# EasyEDA schematic NFC Business Card 2024 Jan 06.json
TITLE: My NFC Hacker Card; REV: 1.0; Date: 2024-01-01; Sheet: 1/1; Drawn By: Karthick Arun; Company: <insert name here> lol
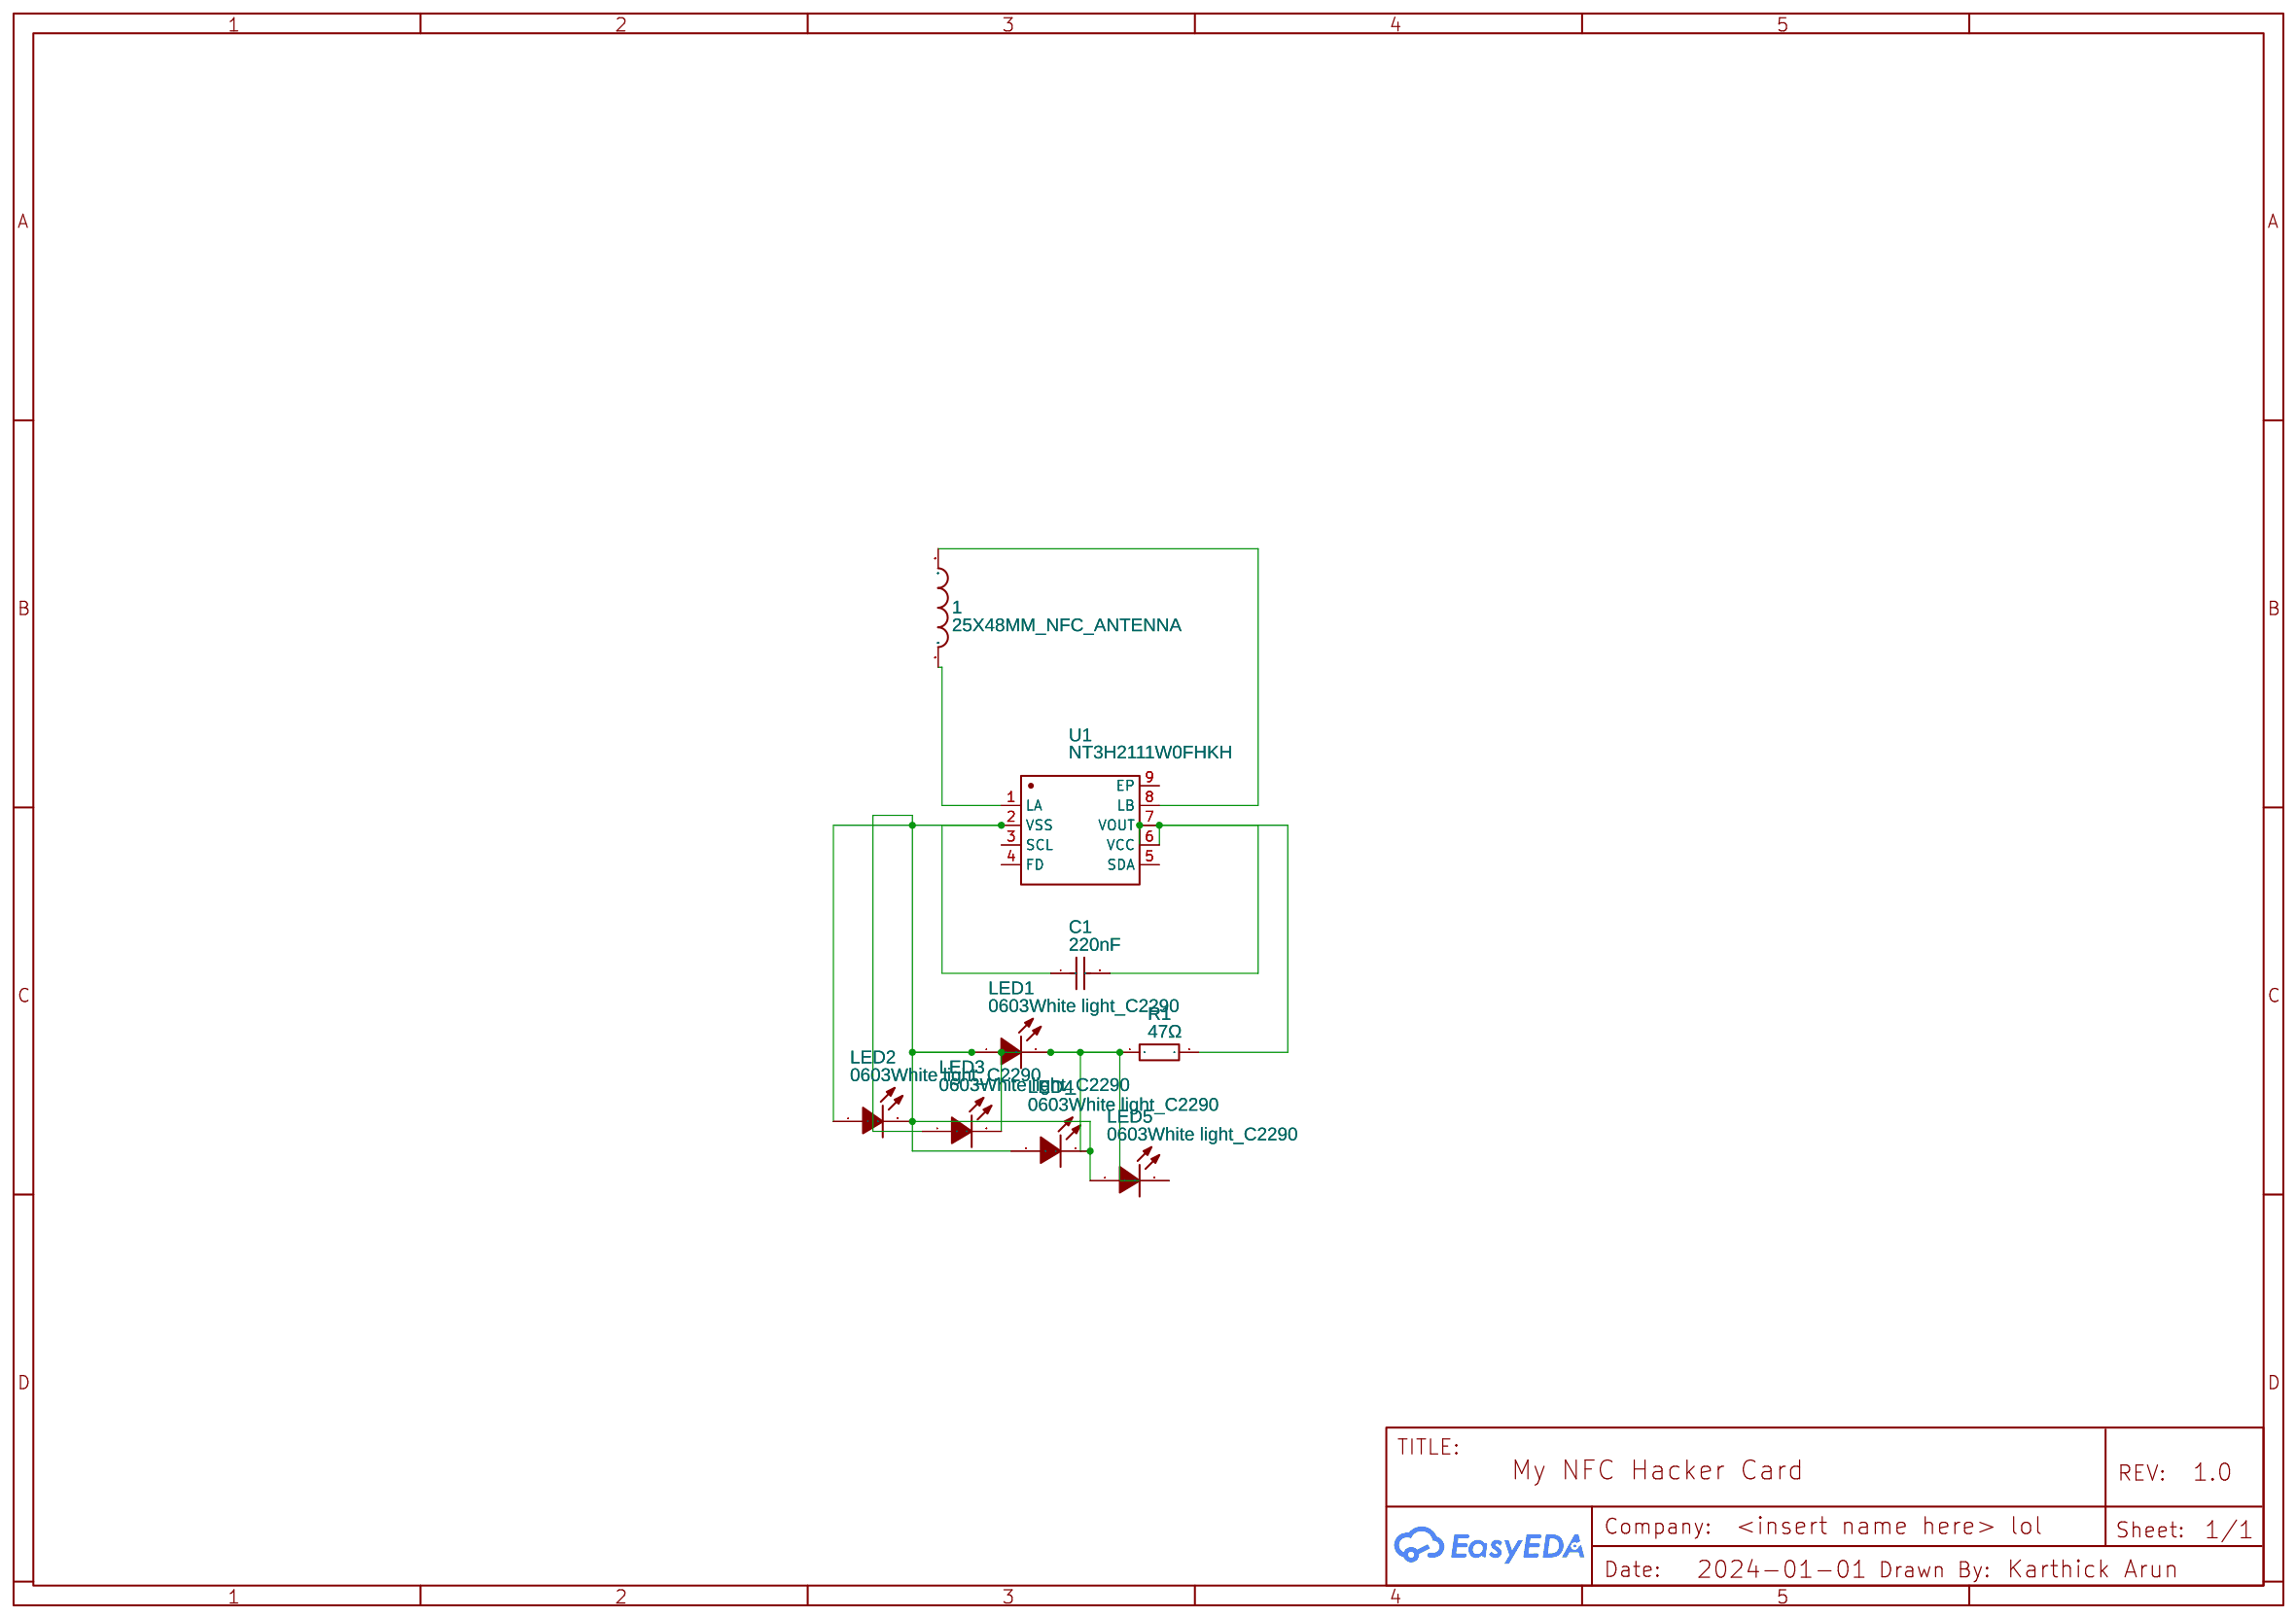
[diagram p0: schematic sheet]

## Parts
1  25X48MM_NFC_ANTENNA  [25X48MM_NFC_ANTENNA]
C1  220nF  [C0603]
LED1  0603White light_C2290  [LED0603-R-RD_WHITE]
LED2  0603White light_C2290  [LED0603-R-RD_WHITE]
LED3  0603White light_C2290  [LED0603-R-RD_WHITE]
LED4  0603White light_C2290  [LED0603-R-RD_WHITE]
LED5  0603White light_C2290  [LED0603-R-RD_WHITE]
R1  47Ω  [R0603]
U1  NT3H2111W0FHKH  [XQFN-8_L1.6-W1.6-P0.50-BL]

## Library data of the parts
1 = 25X48MM_NFC_ANTENNA: Contributor: Dan Schnur
C1 = CL10B224KA8NNNC: Supplier: LCSC; Manufacturer: SAMSUNG(三星); Supplier Part: C21120; JLCPCB Part Class: Basic Part
LED1-LED5 = 0603White light_C2290: Supplier: LCSC; Manufacturer: KENTO; Manufacturer Part: KT-0603白灯; Supplier Part: C2290; JLCPCB Part Class: Basic Part
R1 = 0603WAF470JT5E: Supplier: LCSC; Manufacturer: UNI-ROYAL(厚声); Supplier Part: C23182; JLCPCB Part Class: Basic Part
U1 = NT3H2111W0FHKH: Contributor: LCSC; Supplier: LCSC; Supplier Part: C710403; Manufacturer: NXP(恩智浦); JLCPCB Part Class: Extended Part

## Nets
Net-(1-P$1): 1.P$1 U1.8(LB)
Net-(1-P$2): 1.P$2 U1.1(LA)
Net-(C1-1): C1.1 LED1.1(A) LED1.2(K) LED2.1(A) LED2.2(K) LED3.1(A) LED3.2(K) LED4.1(A) LED4.2(K) LED5.1(A) LED5.2(K) R1.1 U1.2(VSS)
Net-(C1-2): C1.2 R1.2 U1.6(VCC) U1.7(VOUT)

Not connected (* = marked no-connect by the designer): U1 3(SCL) 4(FD) 5(SDA) 9(EP)
